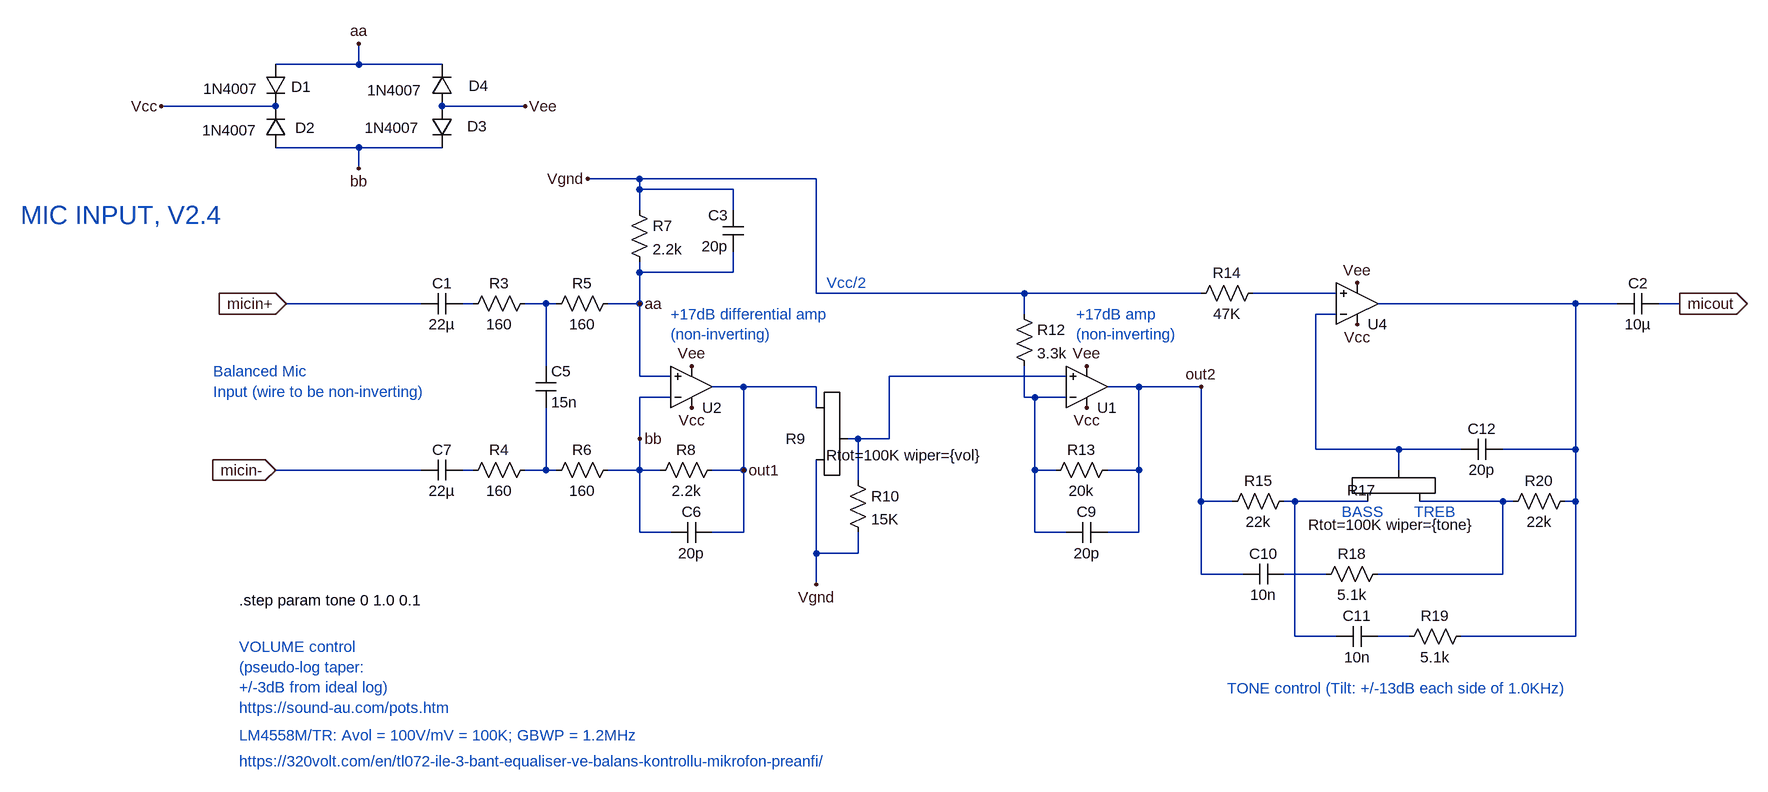
[diagram p0: schematic NewBalancedMicInput_V2.4.asc]
NewBalancedMicInput_V2.4.asc, the LTspice schematic file:
Version 4
SHEET 1 2568 864
WIRE -320 -384 -320 -416
WIRE -320 -384 -448 -384
WIRE -192 -384 -320 -384
WIRE -448 -320 -624 -320
WIRE -64 -320 -192 -320
WIRE -320 -256 -448 -256
WIRE -192 -256 -320 -256
WIRE -320 -224 -320 -256
WIRE 112 -208 32 -208
WIRE 384 -208 112 -208
WIRE 112 -192 112 -208
WIRE 256 -192 112 -192
WIRE 112 -160 112 -192
WIRE 256 -160 256 -192
WIRE 112 -64 112 -80
WIRE 256 -64 256 -96
WIRE 256 -64 112 -64
WIRE 384 -32 384 -208
WIRE 704 -32 384 -32
WIRE 976 -32 704 -32
WIRE 1184 -32 1056 -32
WIRE -224 -16 -432 -16
WIRE -144 -16 -160 -16
WIRE -32 -16 -64 -16
WIRE -16 -16 -32 -16
WIRE 112 -16 112 -64
WIRE 112 -16 64 -16
WIRE 1552 -16 1248 -16
WIRE 1616 -16 1552 -16
WIRE 1712 -16 1680 -16
WIRE 704 0 704 -32
WIRE 1184 0 1152 0
WIRE -32 80 -32 -16
WIRE 112 96 112 -16
WIRE 160 96 112 96
WIRE 768 96 496 96
WIRE 272 112 224 112
WIRE 384 112 272 112
WIRE 880 112 832 112
WIRE 976 112 880 112
WIRE 160 128 112 128
WIRE 704 128 704 80
WIRE 720 128 704 128
WIRE 768 128 720 128
WIRE 384 144 384 112
WIRE 112 192 112 128
WIRE 448 192 432 192
WIRE 496 192 496 96
WIRE 496 192 448 192
WIRE 1152 208 1152 0
WIRE 1280 208 1152 208
WIRE 1376 208 1280 208
WIRE 1552 208 1552 -16
WIRE 1552 208 1440 208
WIRE -224 240 -448 240
WIRE -144 240 -160 240
WIRE -32 240 -32 144
WIRE -32 240 -64 240
WIRE -16 240 -32 240
WIRE 112 240 112 192
WIRE 112 240 64 240
WIRE 144 240 112 240
WIRE 272 240 272 112
WIRE 272 240 224 240
WIRE 720 240 720 128
WIRE 752 240 720 240
WIRE 880 240 880 112
WIRE 880 240 832 240
WIRE 1280 240 1280 208
WIRE 448 256 448 192
WIRE 976 288 976 112
WIRE 1024 288 976 288
WIRE 1120 288 1104 288
WIRE 1232 288 1120 288
WIRE 1440 288 1312 288
WIRE 1456 288 1440 288
WIRE 1552 288 1552 208
WIRE 1552 288 1536 288
WIRE 112 336 112 240
WIRE 160 336 112 336
WIRE 272 336 272 240
WIRE 272 336 224 336
WIRE 720 336 720 240
WIRE 768 336 720 336
WIRE 880 336 880 240
WIRE 880 336 832 336
WIRE 384 368 384 224
WIRE 448 368 448 336
WIRE 448 368 384 368
WIRE 976 400 976 288
WIRE 1040 400 976 400
WIRE 1168 400 1104 400
WIRE 1440 400 1440 288
WIRE 1440 400 1248 400
WIRE 384 416 384 368
WIRE 1120 496 1120 288
WIRE 1184 496 1120 496
WIRE 1296 496 1248 496
WIRE 1552 496 1552 288
WIRE 1552 496 1376 496
FLAG 192 144 Vcc
FLAG 800 144 Vcc
FLAG 1216 16 Vcc
FLAG 272 240 out1
FLAG 976 112 out2
FLAG -448 240 micin-
IOPIN -448 240 In
FLAG -432 -16 micin+
IOPIN -432 -16 In
FLAG 1712 -16 micout
IOPIN 1712 -16 Out
FLAG 32 -208 Vgnd
FLAG 192 80 Vee
FLAG 800 80 Vee
FLAG 1216 -48 Vee
FLAG 384 416 Vgnd
FLAG -624 -320 Vcc
FLAG -64 -320 Vee
FLAG -320 -416 aa
FLAG -320 -224 bb
FLAG 112 -16 aa
FLAG 112 192 bb
SYMBOL Res -48 -32 R90
WINDOW 0 0 56 VBottom 2
WINDOW 3 32 56 VTop 2
SYMATTR InstName R3
SYMATTR Value 160
SYMBOL Res -48 224 R90
WINDOW 0 0 56 VBottom 2
WINDOW 3 32 56 VTop 2
SYMATTR InstName R4
SYMATTR Value 160
SYMBOL Res 80 -32 R90
WINDOW 0 0 56 VBottom 2
WINDOW 3 32 56 VTop 2
SYMATTR InstName R5
SYMATTR Value 160
SYMBOL Res 80 224 R90
WINDOW 0 0 56 VBottom 2
WINDOW 3 32 56 VTop 2
SYMATTR InstName R6
SYMATTR Value 160
SYMBOL Cap -48 80 R0
SYMATTR InstName C5
SYMATTR Value 15n
SYMBOL Res 240 224 R90
WINDOW 0 0 56 VBottom 2
WINDOW 3 32 56 VTop 2
SYMATTR InstName R8
SYMATTR Value 2.2k
SYMBOL Res 96 -176 R0
SYMATTR InstName R7
SYMATTR Value 2.2k
SYMBOL Res 848 224 R90
WINDOW 0 0 56 VBottom 2
WINDOW 3 32 56 VTop 2
SYMATTR InstName R13
SYMATTR Value 20k
SYMBOL Opamps/UniversalOpAmp 1216 -16 M180
SYMATTR InstName U4
SYMATTR Value2 Avol=100K GBW=1Meg Vos=0
SYMBOL Res 1120 272 R90
WINDOW 0 0 56 VBottom 2
WINDOW 3 32 56 VTop 2
SYMATTR InstName R15
SYMATTR Value 22k
SYMBOL Res 1552 272 R90
WINDOW 0 0 56 VBottom 2
WINDOW 3 32 56 VTop 2
SYMATTR InstName R20
SYMATTR Value 22k
SYMBOL Res 1152 416 R270
WINDOW 0 32 56 VTop 2
WINDOW 3 0 56 VBottom 2
SYMATTR InstName R18
SYMATTR Value 5.1k
SYMBOL Res 1280 512 R270
WINDOW 0 32 56 VTop 2
WINDOW 3 0 56 VBottom 2
SYMATTR InstName R19
SYMATTR Value 5.1k
SYMBOL Cap 1248 480 R90
WINDOW 0 0 32 VBottom 2
WINDOW 3 32 32 VTop 2
SYMATTR InstName C11
SYMATTR Value 10n
SYMBOL Cap 1104 384 R90
WINDOW 0 0 32 VBottom 2
WINDOW 3 32 32 VTop 2
SYMATTR InstName C10
SYMATTR Value 10n
SYMBOL Cap 832 320 R90
WINDOW 0 0 32 VBottom 2
WINDOW 3 32 32 VTop 2
SYMATTR InstName C9
SYMATTR Value 20p
SYMBOL Cap 224 320 R90
WINDOW 0 0 32 VBottom 2
WINDOW 3 32 32 VTop 2
SYMATTR InstName C6
SYMATTR Value 20p
SYMBOL Cap 1440 192 R90
WINDOW 0 0 32 VBottom 2
WINDOW 3 32 32 VTop 2
SYMATTR InstName C12
SYMATTR Value 20p
SYMBOL potentiometer_standard 1216 304 R270
WINDOW 39 48 112 Invisible 2
WINDOW 0 33 -15 VRight 2
WINDOW 3 -20 -75 VRight 2
WINDOW 38 38 84 VRight 2
SYMATTR InstName R17
SYMATTR Value Rtot=100K wiper={tone}
SYMBOL potentiometer_standard 368 128 R0
WINDOW 3 31 89 Left 2
WINDOW 39 48 112 Invisible 2
WINDOW 0 -31 64 Left 2
WINDOW 38 39 40 Left 2
SYMATTR Value Rtot=100K wiper={vol}
SYMATTR InstName R9
SYMBOL res 688 -16 R0
SYMATTR InstName R12
SYMATTR Value 3.3k
SYMBOL res 432 240 R0
SYMATTR InstName R10
SYMATTR Value 15K
SYMBOL res 1072 -48 R90
WINDOW 0 0 56 VBottom 2
WINDOW 3 32 56 VTop 2
SYMATTR InstName R14
SYMATTR Value 47K
SYMBOL cap 1680 -32 R90
WINDOW 0 0 32 VBottom 2
WINDOW 3 32 32 VTop 2
SYMATTR InstName C2
SYMATTR Value 10µ
SYMBOL OpAmps\\UniversalOpAmp 800 112 M180
SYMATTR InstName U1
SYMATTR Value2 Avol=100K GBW=1Meg Vos=0
SYMBOL OpAmps\\UniversalOpAmp 192 112 M180
SYMATTR InstName U2
SYMATTR Value2 Avol=100K GBW=1Meg Vos=0
SYMBOL diode -464 -384 R0
WINDOW 0 40 34 Left 2
WINDOW 3 -95 37 Left 2
SYMATTR InstName D1
SYMATTR Value 1N4007
SYMBOL diode -432 -256 R180
WINDOW 0 -45 31 Left 2
WINDOW 3 44 27 Left 2
SYMATTR InstName D2
SYMATTR Value 1N4007
SYMBOL diode -208 -320 R0
WINDOW 0 55 31 Left 2
WINDOW 3 -103 33 Left 2
SYMATTR InstName D3
SYMATTR Value 1N4007
SYMBOL diode -176 -320 R180
WINDOW 0 -56 31 Left 2
WINDOW 3 46 24 Left 2
SYMATTR InstName D4
SYMATTR Value 1N4007
SYMBOL cap -160 -32 R90
WINDOW 0 0 32 VBottom 2
WINDOW 3 32 32 VTop 2
SYMATTR InstName C1
SYMATTR Value 22µ
SYMBOL cap -160 224 R90
WINDOW 0 0 32 VBottom 2
WINDOW 3 32 32 VTop 2
SYMATTR InstName C7
SYMATTR Value 22µ
SYMBOL Cap 272 -96 R180
WINDOW 0 24 56 Left 2
WINDOW 3 24 8 Left 2
SYMATTR InstName C3
SYMATTR Value 20p
TEXT 160 0 Left 2 ;+17dB differential amp\n(non-inverting)
TEXT 784 0 Left 2 ;+17dB amp\n(non-inverting)
TEXT 1016 576 Left 2 ;TONE control (Tilt: +/-13dB each side of 1.0KHz)
TEXT -504 648 Left 2 ;LM4558M/TR: Avol = 100V/mV = 100K; GBWP = 1.2MHz
TEXT 1304 304 Left 2 ;TREB
TEXT 1192 304 Left 2 ;BASS
TEXT -504 512 Left 2 ;VOLUME control\n(pseudo-log taper: \n+/-3dB from ideal log)\nhttps://sound-au.com/pots.htm
TEXT 400 -48 Left 2 ;Vcc/2
TEXT -544 88 Left 2 ;Balanced Mic\nInput (wire to be non-inverting)
TEXT -504 688 Left 2 ;https://320volt.com/en/tl072-ile-3-bant-equaliser-ve-balans-kontrollu-mikrofon-preanfi/
TEXT -840 -152 Left 4 ;MIC INPUT, V2.4
TEXT -504 440 Left 2 !.step param tone 0 1.0 0.1

The netlist it stands for:
* NewBalancedMicInput_V2.4.asc
R3 N003 N002 160
R4 N009 N008 160
R5 aa N003 160
R6 bb N009 160
C5 N003 N009 15n
R8 out1 bb 2.2k
R7 Vgnd aa 2.2k
R13 out2 N007 20k
XU4 N001 N005 Vcc Vee N004 level1 Avol=100K GBW=1Meg Vos=0 En=0 Enk=0 In=0 Ink=0 Rin=500Meg  ; pins In+ In- V+ V- OUT
R15 N010 out2 22k
R20 N004 N011 22k
R18 N012 N011 5.1k
R19 N013 N004 5.1k
C11 N013 N010 10n
C10 N012 out2 10n
C9 out2 N007 20p
C6 out1 bb 20p
C12 N004 N005 20p
XR17 N010 N011 N005 Rtot=100K wiper={tone}
XR9 out1 Vgnd N006 Rtot=100K wiper={vol}
R12 Vgnd N007 3.3k
R10 N006 Vgnd 15K
R14 N001 Vgnd 47K
C2 micout N004 10µ
XU1 N006 N007 Vcc Vee out2 level1 Avol=100K GBW=1Meg Vos=0 En=0 Enk=0 In=0 Ink=0 Rin=500Meg  ; pins In+ In- V+ V- OUT
XU2 aa bb Vcc Vee out1 level1 Avol=100K GBW=1Meg Vos=0 En=0 Enk=0 In=0 Ink=0 Rin=500Meg  ; pins In+ In- V+ V- OUT
D1 aa Vcc 1N4007
D2 bb Vcc 1N4007
D3 Vee bb 1N4007
D4 Vee aa 1N4007
C1 N002 micin+ 22µ
C7 N008 micin- 22µ
C3 aa Vgnd 20p
.model D D
.lib standard.dio
* +17dB differential amp
* (non-inverting)
* +17dB amp
* (non-inverting)
* TONE control (Tilt: +/-13dB each side of 1.0KHz)
* LM4558M/TR: Avol = 100V/mV = 100K; GBWP = 1.2MHz
* TREB
* BASS
* VOLUME control
* (pseudo-log taper:
* +/-3dB from ideal log)
* https://sound-au.com/pots.htm
* Vcc/2
* Balanced Mic
* Input (wire to be non-inverting)
* https://320volt.com/en/tl072-ile-3-bant-equaliser-ve-balans-kontrollu-mikrofon-preanfi/
* MIC INPUT, V2.4
.step param tone 0 1.0 0.1
.lib UniversalOpAmp1.lib
.backanno
.end